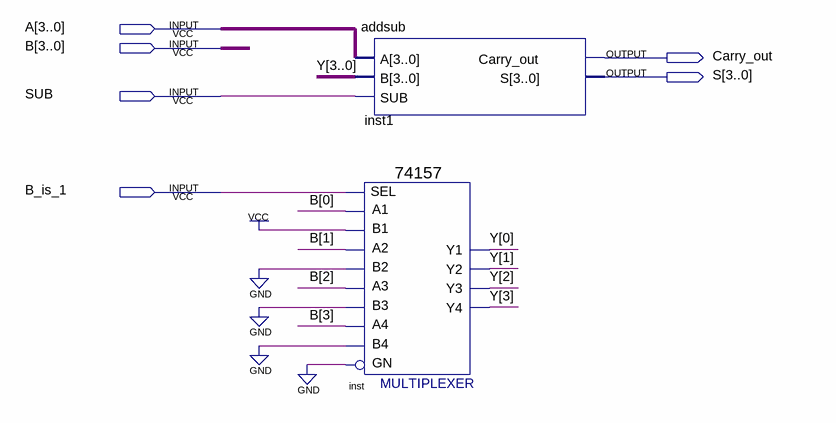
[diagram p0: schematic sheet]
// Quartus schematic extALU.bdf as structural Verilog: 2 symbols, 6 pins
module extALU (
  input  [3:0] A,
  input  [3:0] B,
  input  SUB,
  input  B_is_1,
  output Carry_out,
  output [3:0] S
);

  wire [3:0] Y;

  addsub inst1 (.A(A), .B(Y), .SUB(SUB), .Carry_out(Carry_out), .S(S));
  \74157  inst (
    .A1(B[0]), .B1(1'b1), .SEL(B_is_1), .B2(1'b0), .A3(B[2]), .B3(1'b0), .A2(B[1]), .B4(1'b0), .GN(1'b0),
    .A4(B[3]), .Y2(Y[1]), .Y1(Y[0]), .Y4(Y[3]), .Y3(Y[2]));
endmodule
